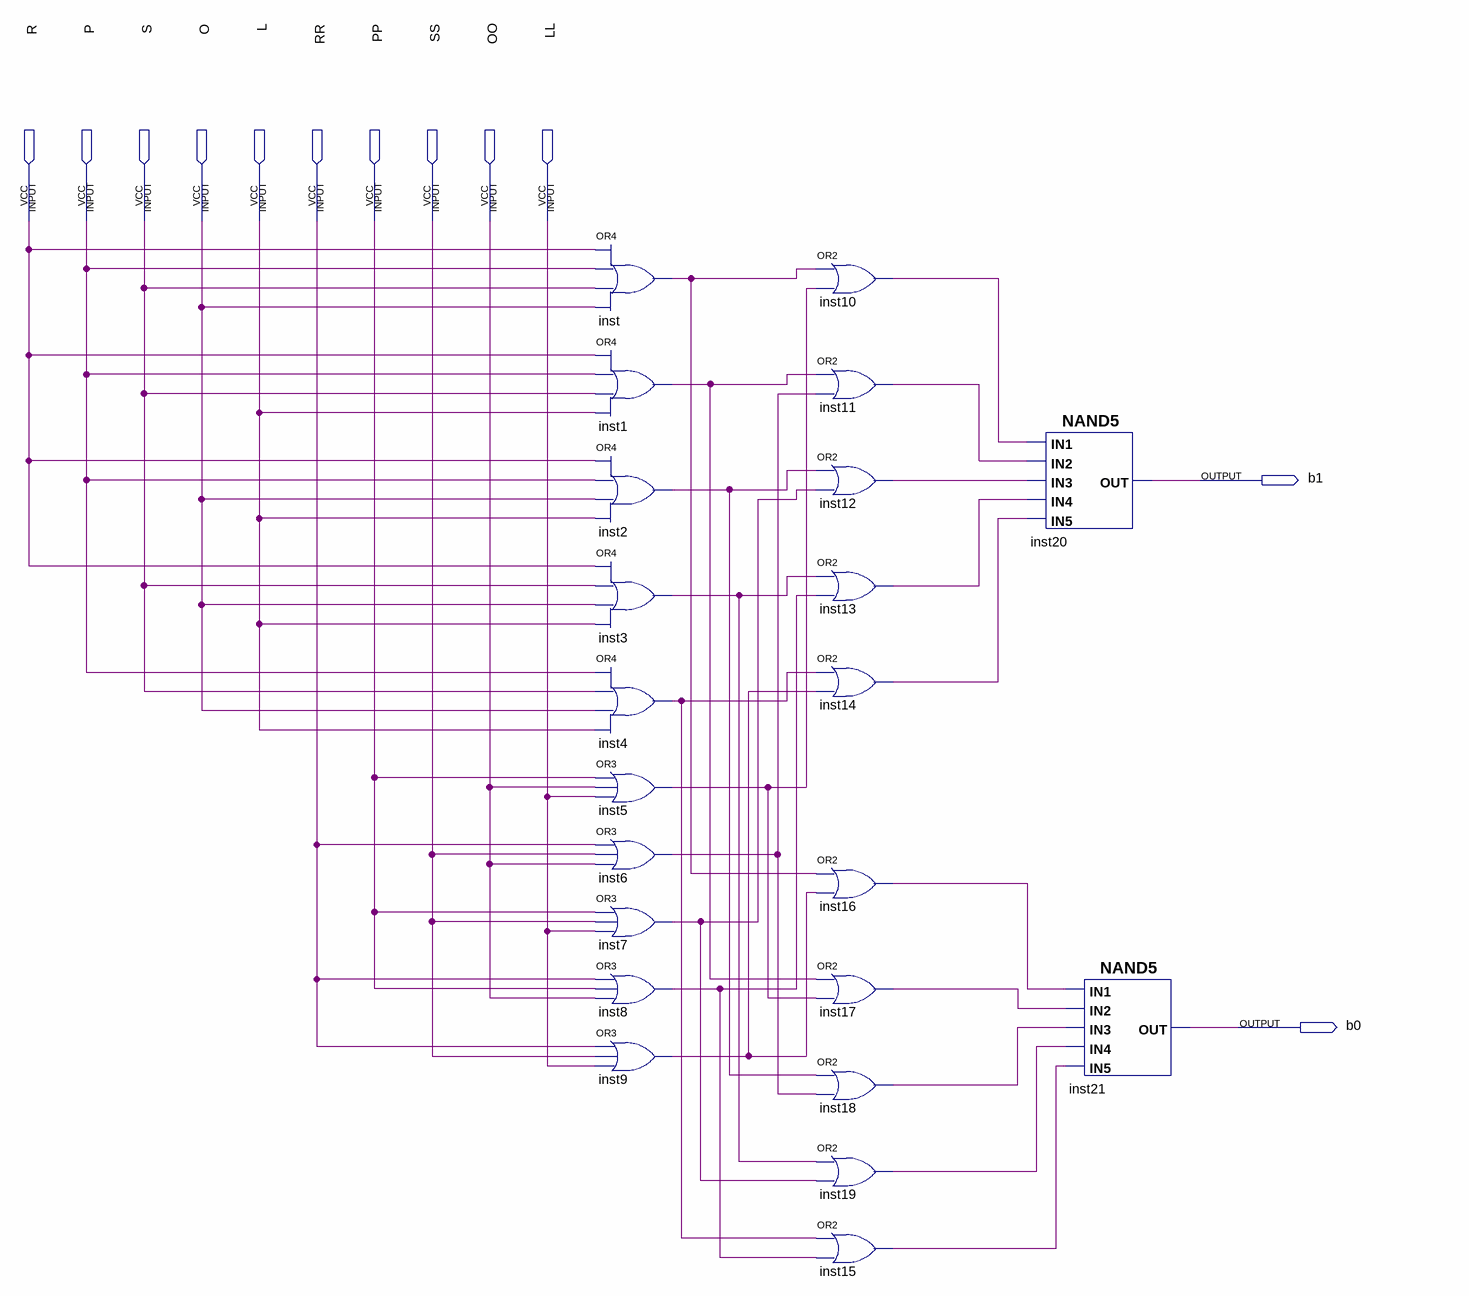
[diagram p0: schematic sheet]
// Quartus schematic whowins.bdf as structural Verilog: 22 symbols, 12 pins
module whowins (
  input  R,
  input  P,
  input  S,
  input  O,
  input  L,
  input  RR,
  input  PP,
  input  SS,
  input  OO,
  input  LL,
  output b1,
  output b0
);

  wire inst1_out, inst2_out, inst3_out, inst4_out, inst5_out, inst6_out, inst7_out, inst8_out, inst9_out,
       inst10_out, inst11_out, inst12_out, inst13_out, inst14_out, inst15_out, inst16_out, inst17_out,
       inst18_out, inst19_out, inst_out;

  or inst (inst_out, R, P, S, O);
  or inst1 (inst1_out, R, P, S, L);
  or inst2 (inst2_out, R, P, O, L);
  or inst3 (inst3_out, R, S, O, L);
  or inst4 (inst4_out, P, S, O, L);
  or inst5 (inst5_out, PP, OO, LL);
  or inst6 (inst6_out, RR, SS, OO);
  or inst7 (inst7_out, PP, SS, LL);
  or inst8 (inst8_out, RR, PP, OO);
  or inst9 (inst9_out, RR, SS, LL);
  or inst10 (inst10_out, inst_out, inst5_out);
  or inst11 (inst11_out, inst1_out, inst6_out);
  or inst12 (inst12_out, inst2_out, inst7_out);
  or inst13 (inst13_out, inst3_out, inst8_out);
  or inst14 (inst14_out, inst4_out, inst9_out);
  or inst16 (inst16_out, inst_out, inst9_out);
  or inst17 (inst17_out, inst1_out, inst5_out);
  or inst18 (inst18_out, inst2_out, inst6_out);
  or inst19 (inst19_out, inst3_out, inst7_out);
  or inst15 (inst15_out, inst4_out, inst8_out);
  nand inst20 (b1, inst10_out, inst11_out, inst12_out, inst13_out, inst14_out);
  nand inst21 (b0, inst16_out, inst17_out, inst18_out, inst19_out, inst15_out);
endmodule
